# EAGLE schematic USBCPowerModule (EAGLE 9.1.1)
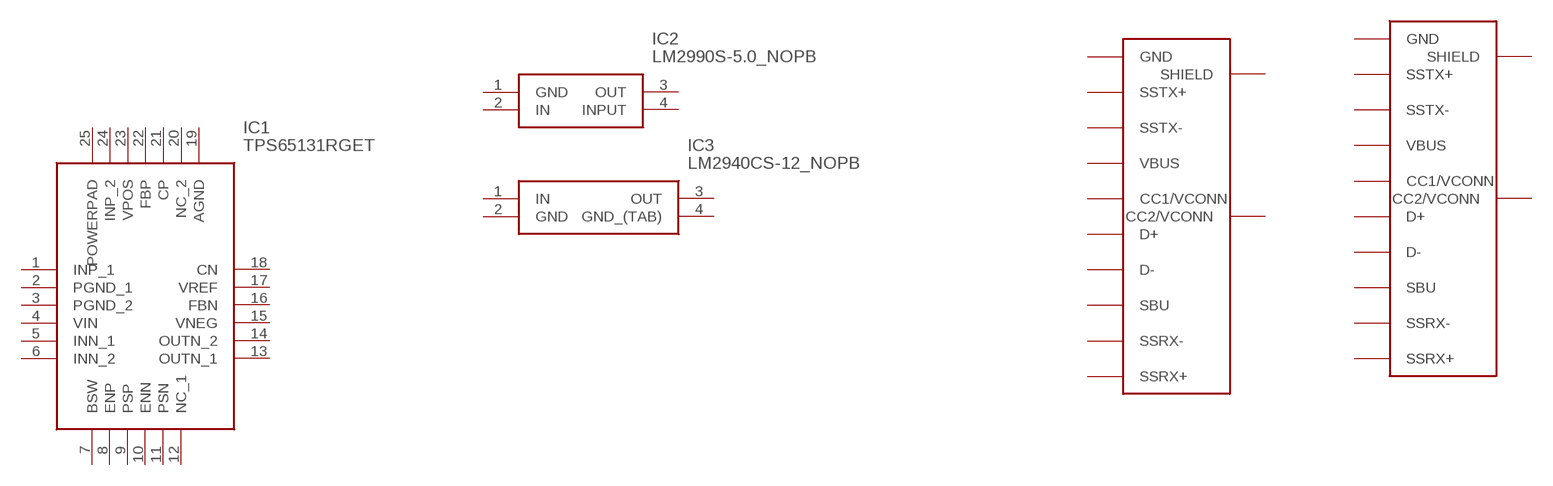
[diagram p0: schematic, sheet 1]

## Parts
IC1  TPS65131RGET  [QFN50P400X400X100-25N]
IC2  LM2990S-5.0_NOPB  [TO254P1435X464-4N]
IC3  LM2940CS-12_NOPB  [TO254P1435X464-4N]
U$1  USB-TYPE-C  [USB-TYPE-C-SMT]
U$2  USB-TYPE-CHYBRID  [USB-TYPE-C-HYBRID]
Unconnected: IC1.1(INP_1) IC1.2(PGND_1) IC1.3(PGND_2) IC1.4(VIN) IC1.5(INN_1) IC1.6(INN_2) IC1.7(BSW) IC1.8(ENP) IC1.9(PSP) IC1.10(ENN) IC1.11(PSN) IC1.12(NC_1) IC1.13(OUTN_1) IC1.14(OUTN_2) IC1.15(VNEG) IC1.16(FBN) IC1.17(VREF) IC1.18(CN) IC1.19(AGND) IC1.20(NC_2) IC1.21(CP) IC1.22(FBP) IC1.23(VPOS) IC1.24(INP_2) IC1.25(POWERPAD) IC2.2(IN) IC2.3(OUT) IC2.4(INPUT) IC3.1(IN) IC3.3(OUT) U$1.2(SSTX+) U$1.3(SSTX-) U$1.4(VBUS) U$1.5(CC1/VCONN) U$1.6(D+) U$1.7(D-) U$1.8(SBU) U$1.9(VBUS) U$1.10(SSRX-) U$1.11(SSRX+) U$1.B2(SSTX+) U$1.B3(SSTX-) U$1.B4(VBUS) U$1.B5(CC2/VCONN) U$1.B6(D+) U$1.B7(D-) U$1.B8(SBU) U$1.B9(VBUS) U$1.B10(SSRX-) U$1.B11(SSRX+) U$1.P$1(SHIELD) U$1.P$2(SHIELD) U$1.P$3(SHIELD) U$1.P$4(SHIELD) U$1.P$5(SHIELD) U$1.P$6(SHIELD) U$1.P$7(SHIELD) U$1.P$8(SHIELD) U$1.P$9(SHIELD) U$1.P$10(SHIELD) U$1.P$11(SHIELD) U$1.P$12(SHIELD) U$1.P$13(SHIELD) U$1.P$14(SHIELD) U$1.P$15(SHIELD) U$1.P$16(SHIELD) U$1.P$17(SHIELD) U$1.P$18(SHIELD) U$1.P$19(SHIELD) U$1.P$20(SHIELD) U$1.P$21(SHIELD) U$1.P$22(SHIELD) U$1.P$23(SHIELD) U$1.P$24(SHIELD) U$1.P$25(SHIELD) U$1.P$26(SHIELD) U$1.P$27(SHIELD) U$1.P$28(SHIELD) U$2.2(SSTX+) U$2.3(SSTX-) U$2.4(VBUS) U$2.5(CC1/VCONN) U$2.6(D+) U$2.7(D-) U$2.8(SBU) U$2.9(VBUS) U$2.10(SSRX-) U$2.11(SSRX+) U$2.B2(SSTX+) U$2.B3(SSTX-) U$2.B4(VBUS) U$2.B5(CC2/VCONN) U$2.B6(D+) U$2.B7(D-) U$2.B8(SBU) U$2.B9(VBUS) U$2.B10(SSRX-) U$2.B11(SSRX+) U$2.P$1(SHIELD) U$2.P$2(SHIELD) U$2.P$3(SHIELD) U$2.P$4(SHIELD) U$2.P$7(SHIELD) U$2.P$8(SHIELD) U$2.P$9(SHIELD) U$2.P$10(SHIELD) U$2.P$11(SHIELD) U$2.P$12(SHIELD) U$2.P$13(SHIELD) U$2.P$14(SHIELD) U$2.P$15(SHIELD) U$2.P$16(SHIELD) U$2.P$17(SHIELD) U$2.P$18(SHIELD) U$2.P$19(SHIELD) U$2.P$20(SHIELD) U$2.P$21(SHIELD) U$2.P$22(SHIELD) U$2.P$23(SHIELD) U$2.P$24(SHIELD) U$2.P$25(SHIELD) U$2.P$26(SHIELD) U$2.P$27(SHIELD) U$2.P$28(SHIELD) U$2.P$29(SHIELD) U$2.P$30(SHIELD) U$2.P$31(SHIELD) U$2.P$32(SHIELD) U$2.P$33(SHIELD) U$2.P$34(SHIELD) U$2.P$35(SHIELD)

## Power pins joined to a net without a drawn wire
GND: IC2.1(GND) IC3.2(GND) U$1.1(GND) U$1.12(GND) U$1.B1(GND) U$1.B12(GND) U$2.1(GND) U$2.12(GND) U$2.B1(GND) U$2.B12(GND)
GND_(TAB): IC3.4(GND_(TAB))

## Library data of the parts
IC1 = SamacSys_Parts:TPS65131RGET: Conv DC-DC Dual-OUT Inv/Step Up 24-Pin Texas Instruments TPS65131RGET, Dual Inverting, Step Up DC-DC Converter, 1.95A, Adjustable Source: Datasheet <http://www.ti.com/lit/ds/symlink/tps65130.pdf>; ARROW_PART_NUMBER: TPS65131RGET; ARROW_PRICE/STOCK: https://www.arrow.com/en/products/tps65131rget/texas-instruments; DESCRIPTION: Conv DC-DC Dual-OUT Inv/Step Up 24-Pin Texas Instruments TPS65131RGET, Dual Inverting, Step Up DC-DC Converter, 1.95A, Adjustable; HEIGHT: 1mm; MANUFACTURER_NAME: Texas Instruments; MANUFACTURER_PART_NUMBER: TPS65131RGET; RS_PART_NUMBER: 6617083P; RS_PRICE/STOCK: http://uk.rs-online.com/web/p/products/6617083P
IC2 = SamacSys_Parts:LM2990S-5.0_NOPB: 1A Negative LDO Regulator LM2990S-5.0 Source: Datasheet <http://www.ti.com/lit/ds/symlink/lm2990.pdf>; ARROW_PART_NUMBER: LM2990S-5.0/NOPB; ARROW_PRICE/STOCK: https://www.arrow.com/en/products/lm2990s-5.0nopb/texas-instruments; DESCRIPTION: 1A Negative LDO Regulator LM2990S-5.0; HEIGHT: 4.64mm; MANUFACTURER_NAME: Texas Instruments; MANUFACTURER_PART_NUMBER: LM2990S-5.0/NOPB; RS_PART_NUMBER: 0460663P; RS_PRICE/STOCK: http://uk.rs-online.com/web/p/products/0460663P
IC3 = SamacSys_Parts:LM2940CS-12_NOPB: 1A,12V,LDO Voltage Regulator,LM2940CS-12 Source: Datasheet <http://www.ti.com/lit/ds/symlink/lm2940c.pdf>; ARROW_PART_NUMBER: LM2940CS-12/NOPB; ARROW_PRICE/STOCK: https://www.arrow.com/en/products/lm2940cs-12nopb/texas-instruments; DESCRIPTION: 1A,12V,LDO Voltage Regulator,LM2940CS-12; HEIGHT: 4.64mm; MANUFACTURER_NAME: Texas Instruments; MANUFACTURER_PART_NUMBER: LM2940CS-12/NOPB; RS_PART_NUMBER: 1624715; RS_PRICE/STOCK: http://uk.rs-online.com/web/p/products/1624715
U$1 U$2 = lio:USB-TYPE-C